# Altium schematic sheet MCU.SchDoc
size A; SheetNumber: 4; SheetTotal: 6
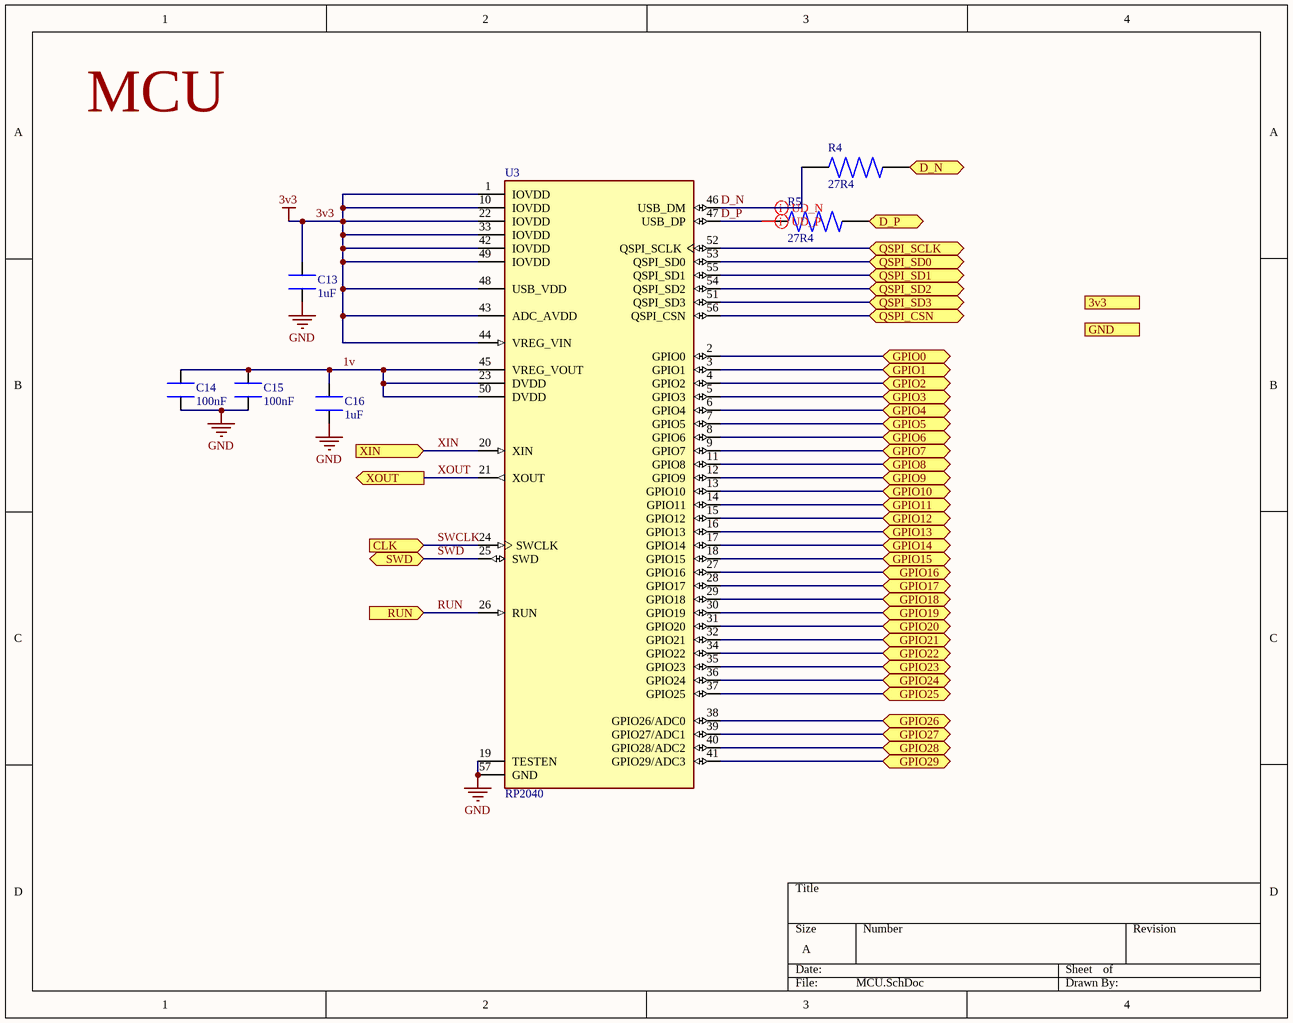
[diagram p0: MCU.SchDoc]

## Parts
C13  1uF  [CC0603KRX5R8BB105]
C14  100nF  [CL10B104KB8NNNC]
C15  100nF  [CL10B104KB8NNNC]
C16  1uF  [CC0603KRX5R8BB105]
R4  27R4  [RC0603FR-0727R4L]
R5  27R4  [RC0603FR-0727R4L]
U3  RP2040  [RP2040]

## Ports
3v3, CLK (in), D_N (bidir), D_P (bidir), GND, GPIO0 (bidir), GPIO1 (bidir), GPIO2 (bidir), GPIO3 (bidir), GPIO4 (bidir), GPIO5 (bidir), GPIO6 (bidir), GPIO7 (bidir), GPIO8 (bidir), GPIO9 (bidir), GPIO10 (bidir), GPIO11 (bidir), GPIO12 (bidir), GPIO13 (bidir), GPIO14 (bidir), GPIO15 (bidir), GPIO16 (bidir), GPIO17 (bidir), GPIO18 (bidir), GPIO19 (bidir), GPIO20 (bidir), GPIO21 (bidir), GPIO22 (bidir), GPIO23 (bidir), GPIO24 (bidir), GPIO25 (bidir), GPIO26 (bidir), GPIO27 (bidir), GPIO28 (bidir), GPIO29 (bidir), QSPI_CSN (bidir), QSPI_SCLK (bidir), QSPI_SD0 (bidir), QSPI_SD1 (bidir), QSPI_SD2 (bidir), QSPI_SD3 (bidir), RUN (in), SWD (bidir), XIN (in), XOUT (out)

## Nets
3v3: C13.1 U3.1(IOVDD) U3.10(IOVDD) U3.22(IOVDD) U3.33(IOVDD) U3.42(IOVDD) U3.43(ADC_AVDD) U3.44(VREG_VIN) U3.48(USB_VDD) U3.49(IOVDD)
GND: C13.2 C14.1 C15.1 C16.2 U3.19(TESTEN) U3.57(GND)
1v: C14.2 C15.2 C16.1 U3.23(DVDD) U3.45(VREG_VOUT) U3.50(DVDD)
D_N: R4.1 U3.46(USB_DM)
D_N: R4.2 ; port D_N  [a separate net that carries the same name]
D_P: R5.1 U3.47(USB_DP)
D_P: R5.2 ; port D_P  [a separate net that carries the same name]
GPIO0: U3.2(GPIO0) ; port GPIO0
GPIO1: U3.3(GPIO1) ; port GPIO1
GPIO2: U3.4(GPIO2) ; port GPIO2
GPIO3: U3.5(GPIO3) ; port GPIO3
GPIO4: U3.6(GPIO4) ; port GPIO4
GPIO5: U3.7(GPIO5) ; port GPIO5
GPIO6: U3.8(GPIO6) ; port GPIO6
GPIO7: U3.9(GPIO7) ; port GPIO7
GPIO8: U3.11(GPIO8) ; port GPIO8
GPIO9: U3.12(GPIO9) ; port GPIO9
GPIO10: U3.13(GPIO10) ; port GPIO10
GPIO11: U3.14(GPIO11) ; port GPIO11
GPIO12: U3.15(GPIO12) ; port GPIO12
GPIO13: U3.16(GPIO13) ; port GPIO13
GPIO14: U3.17(GPIO14) ; port GPIO14
GPIO15: U3.18(GPIO15) ; port GPIO15
GPIO16: U3.27(GPIO16) ; port GPIO16
GPIO17: U3.28(GPIO17) ; port GPIO17
GPIO18: U3.29(GPIO18) ; port GPIO18
GPIO19: U3.30(GPIO19) ; port GPIO19
GPIO20: U3.31(GPIO20) ; port GPIO20
GPIO21: U3.32(GPIO21) ; port GPIO21
GPIO22: U3.34(GPIO22) ; port GPIO22
GPIO23: U3.35(GPIO23) ; port GPIO23
GPIO24: U3.36(GPIO24) ; port GPIO24
GPIO25: U3.37(GPIO25) ; port GPIO25
GPIO26: U3.38(GPIO26/ADC0) ; port GPIO26
GPIO27: U3.39(GPIO27/ADC1) ; port GPIO27
GPIO28: U3.40(GPIO28/ADC2) ; port GPIO28
GPIO29: U3.41(GPIO29/ADC3) ; port GPIO29
QSPI_CSN: U3.56(QSPI_CSN) ; port QSPI_CSN
QSPI_SCLK: U3.52(QSPI_SCLK) ; port QSPI_SCLK
QSPI_SD0: U3.53(QSPI_SD0) ; port QSPI_SD0
QSPI_SD1: U3.55(QSPI_SD1) ; port QSPI_SD1
QSPI_SD2: U3.54(QSPI_SD2) ; port QSPI_SD2
QSPI_SD3: U3.51(QSPI_SD3) ; port QSPI_SD3
RUN: U3.26(RUN) ; port RUN
SWCLK: U3.24(SWCLK) ; port CLK
SWD: U3.25(SWD) ; port SWD
XIN: U3.20(XIN) ; port XIN
XOUT: U3.21(XOUT) ; port XOUT

## Layout directives
differential pair; differential pair class UDiff: D_N, D_P

## Notes on the sheet
- MCU

## Library data of the parts
C13 C16 = CC0603KRX5R8BB105: SMD ceramic capasitor 1uF; MF: Yageo; SnapEDA_Link: https://www.snapeda.com/parts/CC0603KRX5R8BB105/Yageo/view-part/1820893/?ref=snap; Package: 0603 Yageo; Price: None; Value: *; MP: CC0603KRX5R8BB105; Availability: Unavailable
C14 C15 = CL10B104KB8NNNC: SMD ceramic capacitor 0.1µF, tolerance ±10% 50V 0603 _1608 Metric_; MF: Samsung Electro-Mechanics; Price: None; MP: CL10B104KB8NNNC; SnapEDA_Link: https://www.snapeda.com/parts/CL10B104KB8NNNC/Samsung%20Electro-Mechanics/view-part/3598309/?ref=snap; Availability: Unavailable; Package: 0603 Samsung; Value: *
R4 R5 = RC0603FR-0727R4L: RES SMD 27.4 OHM 1% 1/10W 0603; Package: None; Price: None; Value: *; MP: RC0603FR-0727R4L; Availability: Unavailable
U3 = RP2040: RP2040 chip for Raspberry Pi Pico - ARM® Cortex®-M0+ MCU 32-Bit; SnapEDA_Link: https://www.snapeda.com/parts/RP2040/Raspberry+Pi/view-part/?ref=snap; Package: None; Value: *; MF: Raspberry Pi; MP: RP2040; Check_prices: https://www.snapeda.com/parts/RP2040/Raspberry+Pi/view-part/?ref=eda